# Altium project TAUV_Acoustics_V2.PrjPcb
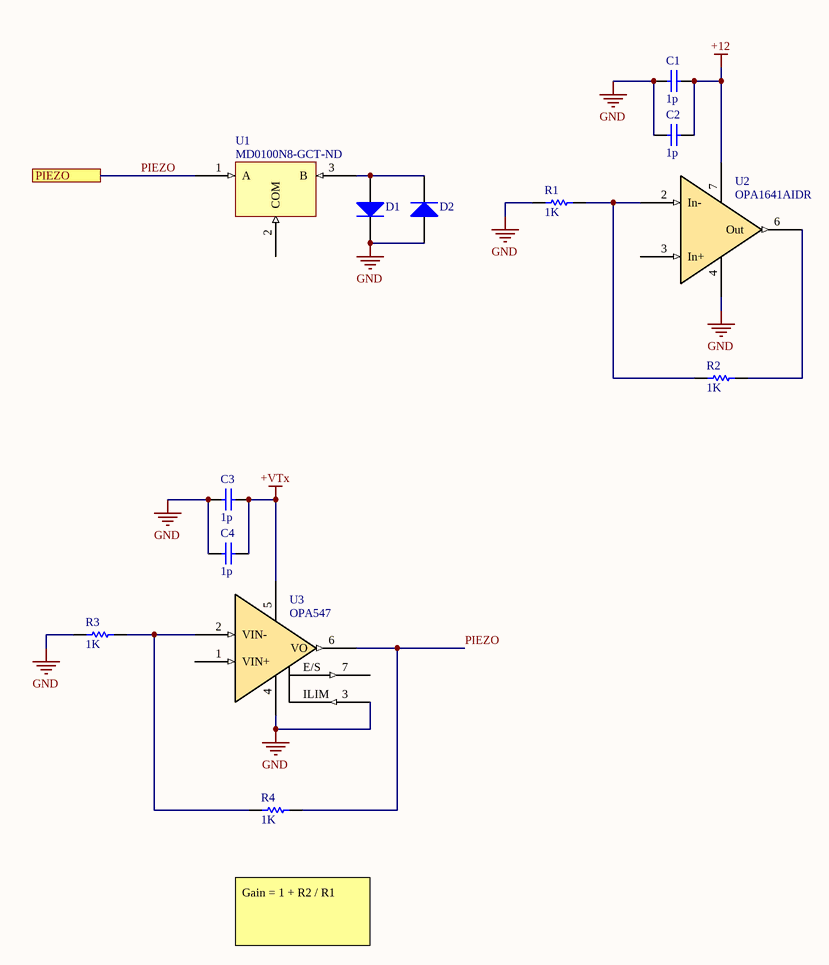
[diagram p0: Channel.SchDoc]
4 sheets, 51 parts. Net scope: flat (ports and power ports of the same name join across sheets).
Sheets:
  Channel.SchDoc
  Fliege_Notch_Sim.SchDoc
  Fliege_Notch.SchDoc
  Biquad.SchDoc

## Sheet Channel.SchDoc
size A; SheetNumber: 2; SheetTotal: 3

### Parts
C1  value 1p  (hidden comment: Capacitor)
C2  value 1p  (hidden comment: Capacitor)
C3  value 1p  (hidden comment: Capacitor)
C4  value 1p  (hidden comment: Capacitor)
D1  Diode  (value not drawn)
D2  Diode  (value not drawn)
R1  value 1K  (hidden comment: Resistor)
R2  value 1K  (hidden comment: Resistor)
R3  value 1K  (hidden comment: Resistor)
R4  value 1K  (hidden comment: Resistor)
U1  MD0100N8-GCT-ND
U2  OPA1641AIDR
U3  OPA547

### Ports
PIEZO

### Nets
+12: C1.2 C2.2 U2.7(V+)
+VTx: C3.2 C4.2 U3.5(V+)
GND: C1.1 C2.1 C3.1 C4.1 D1.2(K) D2.1(A) R1.2 R3.2 U2.4(V-) U3.3(ILIM) U3.4(V-)
PIEZO: R4.2 U1.1(A) U3.6(VO) ; port PIEZO
NetD1_1: D1.1(A) D2.2(K) U1.3(B)
NetR1_1: R1.1 R2.2 U2.2(In-)
NetR2_1: R2.1 U2.6(Out)
NetR3_1: R3.1 R4.1 U3.2(VIN-)

Not connected (* = marked no-connect by the designer): U1 2(COM); U2 3(In+); U3 1(VIN+) 7(E/S)

### Notes on the sheet
- Gain = 1 + R2 / R1

### Library data of the parts
C1-C4 = Capacitor: SimulationGenericComponent: True
D1 D2 = Diode: AF: 1; BV: 0; BV_MAX: 1e99; EG: 1.11; FC: 0.5; IBV: 0.001; ISR: 1e-14; MJSW: 0.33; NTUN: 30; TNOM: 27; XTI: 3; SimulationGenericComponent: True; CJO: 0; CJP: 0; CTA: 0; CTP: 0; FCS: 0.5; FV_MAX: 1e99; IKF: 0; IKR: 0; JSW: 0; JTUN: 0; JTUNSW: 0; KEG: 1; KF: 0; LEVEL: 1; N: 1; NBV: 1; NR: 1; NS: 1; PHP: 1; RS: 0; TCV: 0; TLEV: 0; TLEVC: 0; TM1: 0; TM2: 0; TPB: 0; TPHP: 0; TRS: 0; TRS2: 0; TT: 0; TTT1: 0; TTT2: 0; VJ: 1; XTITUN: 3; IS: 1e-14
R1-R4 = Resistor: TC1: 0; SimulationGenericComponent: True; TC2: 0
U1 = MD0100N8-GCT-ND: T/R Switch
U2 = OPA1641AIDR: JFET-input audio op-amp, 1 channel
U3 = OPA547: High-voltage, high-current op-amp

## Sheet Fliege_Notch_Sim.SchDoc
size A; SheetNumber: 4; SheetTotal: 5
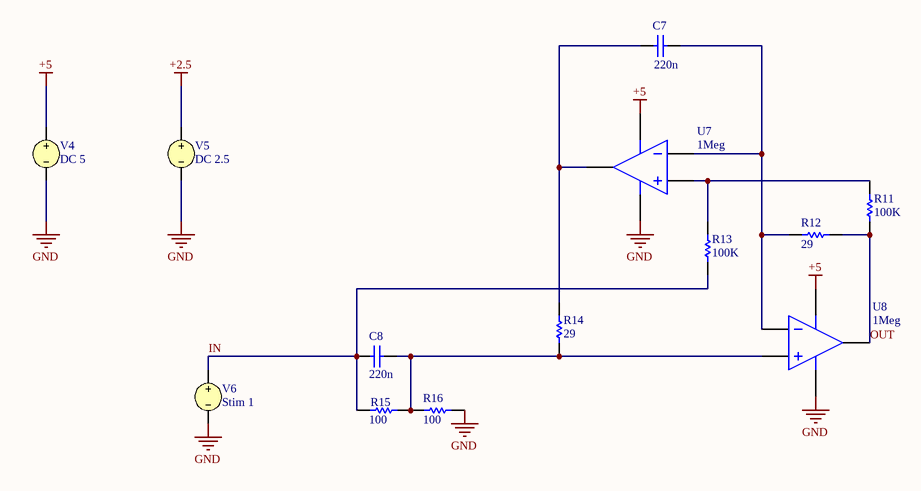
[diagram p1: Fliege_Notch_Sim.SchDoc]

### Parts
C7  value 220n  (hidden comment: Capacitor)
C8  value 220n  (hidden comment: Capacitor)
R11  value 100K  (hidden comment: Resistor)
R12  value 29  (hidden comment: Resistor)
R13  value 100K  (hidden comment: Resistor)
R14  value 29  (hidden comment: Resistor)
R15  value 100  (hidden comment: Resistor)
R16  value 100  (hidden comment: Resistor)
U7  GAIN: 1Meg  (hidden comment: Ideal Operational Amplifier)
U8  GAIN: 1Meg  (hidden comment: Ideal Operational Amplifier)
V4  DC 5
V5  DC 2.5
V6  Stim 1

### Nets
+2.5: V5.1
+5: U7.4(V+) U8.4(V+) V4.1
GND: R16.1 U7.5(V-) U8.5(V-) V4.2 V5.2 V6.2
IN: C8.1 R13.2 R15.1 V6.1
OUT: R11.2 R12.1 U8.3(OUT)
NetC7_1: C7.1 R14.1 U7.3(OUT)
NetC7_2: C7.2 R12.2 U7.1(IN-) U8.1(IN-)
NetC8_2: C8.2 R14.2 R15.2 R16.2 U8.2(IN+)
NetR11_1: R11.1 R13.1 U7.2(IN+)

### Library data of the parts
C7 C8 = Capacitor: SimulationGenericComponent: True
R11-R16 = Resistor: TC1: 0; SimulationGenericComponent: True; TC2: 0
U7 U8 = OpAmp with power terminals: SimulationGenericComponent: True
V4 = VSRC: Voltage Source; Note: PCB Footprint - Not required; AC Magnitude: 1; AC Phase: 0; Value: 5; Published: 8-Jun-2000; LatestRevisionDate: 17-Jul-2002; LatestRevisionNote: Re-released for DXP Platform.; PackageReference: Not Applicable; Publisher: Altium Limited
V5 = VSRC: Voltage Source; Note: PCB Footprint - Not required; AC Magnitude: 1; AC Phase: 0; Value: 2.5; Published: 8-Jun-2000; LatestRevisionDate: 17-Jul-2002; LatestRevisionNote: Re-released for DXP Platform.; PackageReference: Not Applicable; Publisher: Altium Limited
V6 = VSRC: Voltage Source; Note: PCB Footprint - Not required; AC Magnitude: 1; AC Phase: 0; DC Magnitude: 2.5; Frequency: 1Meg; Published: 8-Jun-2000; LatestRevisionDate: 17-Jul-2002; LatestRevisionNote: Re-released for DXP Platform.; PackageReference: Not Applicable; Publisher: Altium Limited; Offset: 0; Amplitude: 1; Delay: 0; Damping Factor: 0; Phase: 0

## Sheet Fliege_Notch.SchDoc
size A; SheetNumber: 5; SheetTotal: 6
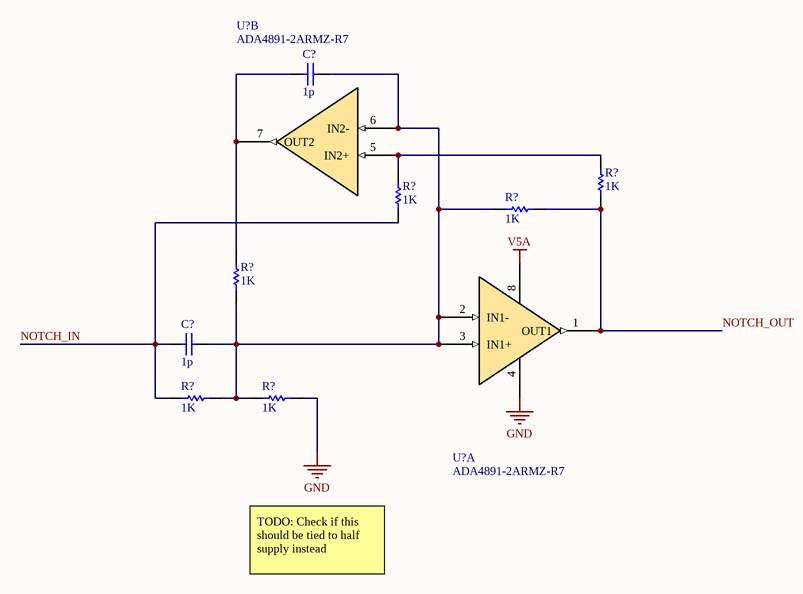
[diagram p2: Fliege_Notch.SchDoc]

### Parts
(Parts that share a designator on the sheet are numbered #1, #2 ... from top to bottom, then left to right.)
C?#1  value 1p  (hidden comment: Capacitor)
C?#2  value 1p  (hidden comment: Capacitor)
R?#1  value 1K  (hidden comment: Resistor)
R?#2  value 1K  (hidden comment: Resistor)
R?#3  value 1K  (hidden comment: Resistor)
R?#4  value 1K  (hidden comment: Resistor)
R?#5  value 1K  (hidden comment: Resistor)
R?#6  value 1K  (hidden comment: Resistor)
U?#1  ADA4891-2ARMZ-R7  (part B of 2)
U?#2  ADA4891-2ARMZ-R7  (part A of 2)

### Nets
GND: R?#6.2 U?#2.4(V-)
V5A: U?#2.8(V+)
NOTCH_IN: C?#2.1 R?#3.1 R?#5.1
NOTCH_OUT: R?#1.1 R?#2.1 U?#2.1(OUT1)
NetC?#1_1: C?#1.1 R?#4.2 U?#1.7(OUT2)
NetC?#1_2: C?#1.2 C?#2.2 R?#1.2 R?#4.1 R?#5.2 R?#6.1 U?#1.6(IN2-) U?#2.2(IN1-) U?#2.3(IN1+)
NetR?#2_2: R?#2.2 R?#3.2 U?#1.5(IN2+)

### Notes on the sheet
- TODO: Check if this should be tied to half supply instead

### Library data of the parts
C?#1 C?#2 = Capacitor: SimulationGenericComponent: True
R?#1-R?#6 = Resistor: TC1: 0; SimulationGenericComponent: True; TC2: 0
U?#1 U?#2 = ADA4891-2ARMZ-R7: CMOS Amplifier 2 Circuit Rail-to-Rail 8-MSOP

## Sheet Biquad.SchDoc
size A; SheetNumber: 6; SheetTotal: 6
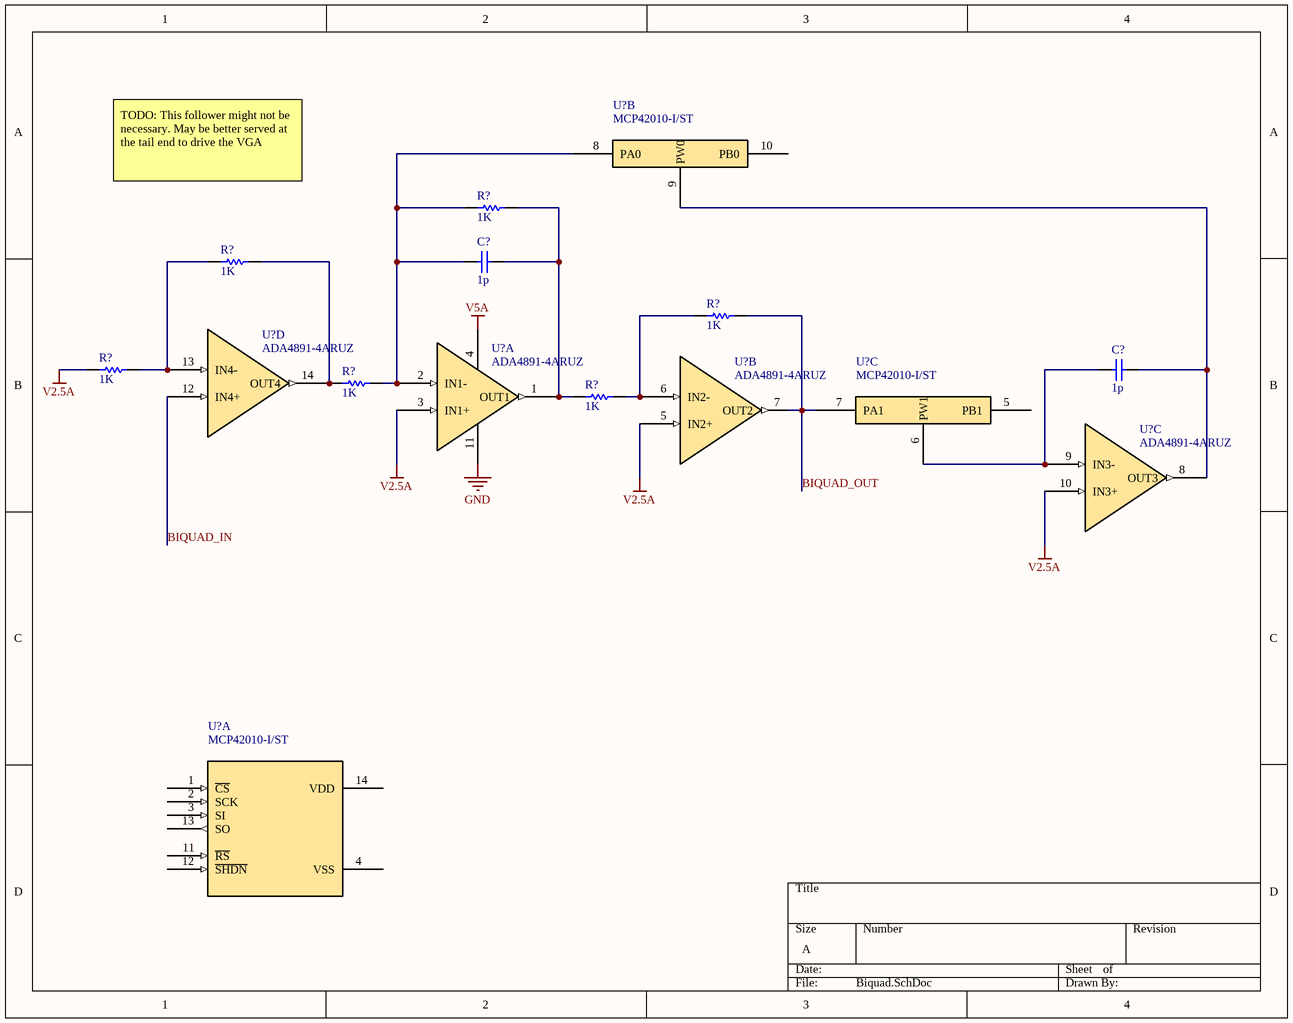
[diagram p3: Biquad.SchDoc]

### Parts
(Parts that share a designator on the sheet are numbered #1, #2 ... from top to bottom, then left to right.)
C?#3  value 1p  (hidden comment: Capacitor)
C?#4  value 1p  (hidden comment: Capacitor)
R?#7  value 1K  (hidden comment: Resistor)
R?#8  value 1K  (hidden comment: Resistor)
R?#9  value 1K  (hidden comment: Resistor)
R?#10  value 1K  (hidden comment: Resistor)
R?#11  value 1K  (hidden comment: Resistor)
R?#12  value 1K  (hidden comment: Resistor)
U?#3  MCP42010-I/ST  (part B of 3)
U?#4  ADA4891-4ARUZ  (part D of 4)
U?#5  ADA4891-4ARUZ  (part A of 4)
U?#6  ADA4891-4ARUZ  (part B of 4)
U?#7  MCP42010-I/ST  (part C of 3)
U?#8  ADA4891-4ARUZ  (part C of 4)
U?#9  MCP42010-I/ST  (part A of 3)

### Nets
GND: U?#5.11(V-)
V2.5A: R?#10.1 U?#5.3(IN1+) U?#6.5(IN2+) U?#8.10(IN3+)
V5A: U?#5.4(V+)
BIQUAD_IN: U?#4.12(IN4+)
BIQUAD_OUT: R?#9.2 U?#6.7(OUT2) U?#7.7(PA1)
NetC?#3_1: C?#3.1 R?#7.1 R?#11.2 U?#3.8(PA0) U?#5.2(IN1-)
NetC?#3_2: C?#3.2 R?#7.2 R?#12.1 U?#5.1(OUT1)
NetC?#4_1: C?#4.1 U?#7.6(PW1) U?#8.9(IN3-)
NetC?#4_2: C?#4.2 U?#3.9(PW0) U?#8.8(OUT3)
NetR?#8_1: R?#8.1 R?#10.2 U?#4.13(IN4-)
NetR?#8_2: R?#8.2 R?#11.1 U?#4.14(OUT4)
NetR?#9_1: R?#9.1 R?#12.2 U?#6.6(IN2-)

Not connected (* = marked no-connect by the designer): U?#3 10(PB0); U?#7 5(PB1); U?#9 1(~{CS}) 2(SCK) 3(SI) 4(VSS) 11(~{RS}) 12(~{SHDN}) 13(SO) 14(VDD)

### Notes on the sheet
- TODO: This follower might not be necessary. May be better served at the tail end to drive the VGA

### Library data of the parts
C?#3 C?#4 = Capacitor: SimulationGenericComponent: True
R?#7-R?#12 = Resistor: TC1: 0; SimulationGenericComponent: True; TC2: 0
U?#3 U?#7 U?#9 = MCP42010-I/ST: Digital Potentiometer 10k Ohm 2 Circuit 256 Taps SPI Interface 14-TSSOP
U?#4-U?#6 U?#8 = ADA4891-4ARUZ: CMOS Amplifier 4 Circuit Rail-to-Rail 14-TSSOP

## Nets that join several sheets
GND: Channel (11 pins), Fliege_Notch_Sim (6 pins), Fliege_Notch (R?#6.2 U?#2.4), Biquad (U?#5.11)
V5A: Fliege_Notch (U?#2.8), Biquad (U?#5.4)